# EAGLE design Escubo de LED (EAGLE 6.1)
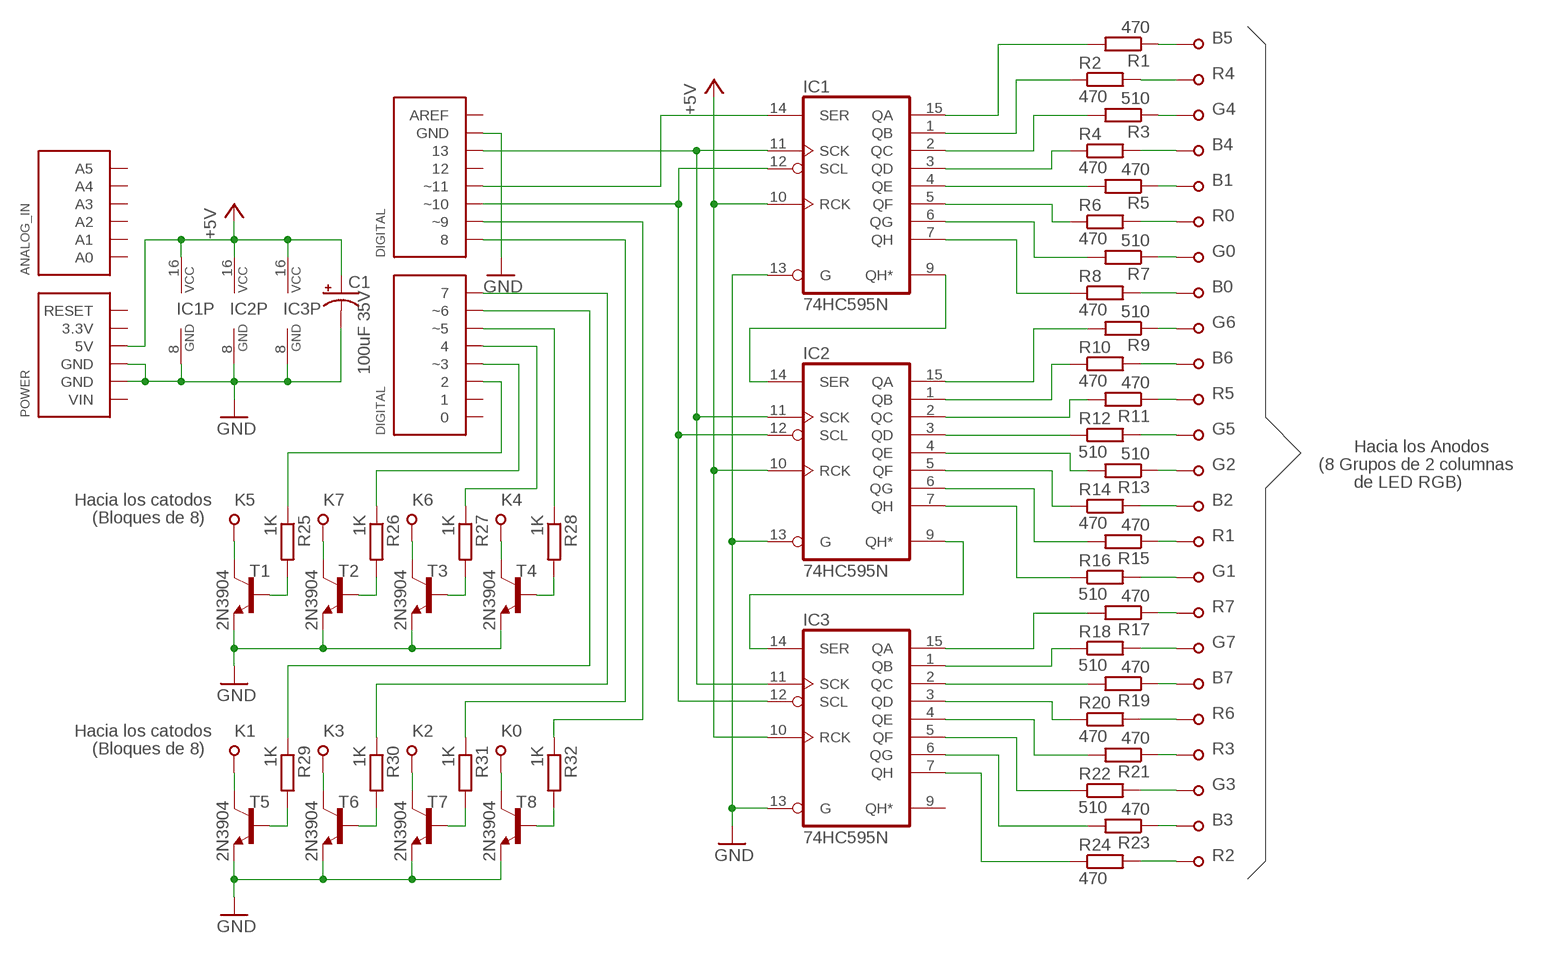
[diagram p0: schematic, sheet 1]

## Parts
C1  100uF 35V  CPOL-USE3.5-8  [E3,5-8]
IC1  74HC595N  [DIP16]
IC2  74HC595N  [DIP16]
IC3  74HC595N  [DIP16]
R1  470  R-EU_0204/7  [0204/7]
R2  470  R-EU_0204/7  [0204/7]
R3  510  R-EU_0204/7  [0204/7]
R4  470  R-EU_0204/7  [0204/7]
R5  470  R-EU_0207/12  [0207/12]
R6  470  R-EU_0207/10  [0207/10]
R7  510  R-EU_0204/7  [0204/7]
R8  470  R-EU_0204/5  [0204/5]
R9  510  R-EU_0204/7  [0204/7]
R10  470  R-EU_0204/7  [0204/7]
R11  470  R-EU_0204/7  [0204/7]
R12  510  R-EU_0204/7  [0204/7]
R13  510  R-EU_0207/12  [0207/12]
R14  470  R-EU_0207/10  [0207/10]
R15  470  R-EU_0204/7  [0204/7]
R16  510  R-EU_0204/5  [0204/5]
R17  470  R-EU_0204/7  [0204/7]
R18  510  R-EU_0204/7  [0204/7]
R19  470  R-EU_0204/7  [0204/7]
R20  470  R-EU_0204/7  [0204/7]
R21  470  R-EU_0207/12  [0207/12]
R22  510  R-EU_0207/10  [0207/10]
R23  470  R-EU_0204/7  [0204/7]
R24  470  R-EU_0204/5  [0204/5]
R25  1K  R-EU_0204/2V  [0204V]
R26  1K  R-EU_0204/2V  [0204V]
R27  1K  R-EU_0204/2V  [0204V]
R28  1K  R-EU_0204/2V  [0204V]
R29  1K  R-EU_0204/2V  [0204V]
R30  1K  R-EU_0204/2V  [0204V]
R31  1K  R-EU_0204/2V  [0204V]
R32  1K  R-EU_0204/2V  [0204V]
S1  ARDUINO_SHIELD  [ARDUINO_SHIELD]
T1  2N3904  2N3904-NPN-TO92-EBC  [TO92-EBC]
T2  2N3904  2N3904-NPN-TO92-EBC  [TO92-EBC]
T3  2N3904  2N3904-NPN-TO92-EBC  [TO92-EBC]
T4  2N3904  2N3904-NPN-TO92-EBC  [TO92-EBC]
T5  2N3904  2N3904-NPN-TO92-EBC  [TO92-EBC]
T6  2N3904  2N3904-NPN-TO92-EBC  [TO92-EBC]
T7  2N3904  2N3904-NPN-TO92-EBC  [TO92-EBC]
T8  2N3904  2N3904-NPN-TO92-EBC  [TO92-EBC]
U$1  PAD_SIMPLE_PTH  [PAD_SIMPLE_PTH]
U$2  PAD_SIMPLE_PTH  [PAD_SIMPLE_PTH]
U$3  PAD_SIMPLE_PTH  [PAD_SIMPLE_PTH]
U$4  PAD_SIMPLE_PTH  [PAD_SIMPLE_PTH]
U$5  PAD_SIMPLE_PTH  [PAD_SIMPLE_PTH]
U$6  PAD_SIMPLE_PTH  [PAD_SIMPLE_PTH]
U$7  PAD_SIMPLE_PTH  [PAD_SIMPLE_PTH]
U$8  PAD_SIMPLE_PTH  [PAD_SIMPLE_PTH]
U$9  PAD_SIMPLE_PTH  [PAD_SIMPLE_PTH]
U$10  PAD_SIMPLE_PTH  [PAD_SIMPLE_PTH]
U$11  PAD_SIMPLE_PTH  [PAD_SIMPLE_PTH]
U$12  PAD_SIMPLE_PTH  [PAD_SIMPLE_PTH]
U$13  PAD_SIMPLE_PTH  [PAD_SIMPLE_PTH]
U$14  PAD_SIMPLE_PTH  [PAD_SIMPLE_PTH]
U$15  PAD_SIMPLE_PTH  [PAD_SIMPLE_PTH]
U$16  PAD_SIMPLE_PTH  [PAD_SIMPLE_PTH]
U$17  PAD_SIMPLE_PTH  [PAD_SIMPLE_PTH]
U$18  PAD_SIMPLE_PTH  [PAD_SIMPLE_PTH]
U$19  PAD_SIMPLE_PTH  [PAD_SIMPLE_PTH]
U$20  PAD_SIMPLE_PTH  [PAD_SIMPLE_PTH]
U$21  PAD_SIMPLE_PTH  [PAD_SIMPLE_PTH]
U$22  PAD_SIMPLE_PTH  [PAD_SIMPLE_PTH]
U$23  PAD_SIMPLE_PTH  [PAD_SIMPLE_PTH]
U$24  PAD_SIMPLE_PTH  [PAD_SIMPLE_PTH]
U$25  PAD_SIMPLE_PTH  [PAD_SIMPLE_PTH]
U$26  PAD_SIMPLE_PTH  [PAD_SIMPLE_PTH]
U$27  PAD_SIMPLE_PTH  [PAD_SIMPLE_PTH]
U$28  PAD_SIMPLE_PTH  [PAD_SIMPLE_PTH]
U$29  PAD_SIMPLE_PTH  [PAD_SIMPLE_PTH]
U$30  PAD_SIMPLE_PTH  [PAD_SIMPLE_PTH]
U$31  PAD_SIMPLE_PTH  [PAD_SIMPLE_PTH]
U$32  PAD_SIMPLE_PTH  [PAD_SIMPLE_PTH]

## Nets
+5V: C1.+ IC1.10(RCK) IC1.16(VCC) IC2.10(RCK) IC2.16(VCC) IC3.10(RCK) IC3.16(VCC) S1.5V(_POWER:5V)
GND: C1.- IC1.8(GND) IC1.13(G) IC2.8(GND) IC2.13(G) IC3.8(GND) IC3.13(G) S1.GND(_POWER:GND) S1.GND@1(_POWER:GND) S1.GND@2(_DIGITAL_H:GND) T1.E T2.E T3.E T4.E T5.E T6.E T7.E T8.E
N$1: IC1.9(QH*) IC2.14(SER)
N$2: IC2.9(QH*) IC3.14(SER)
N$3: IC1.11(SCK) IC2.11(SCK) IC3.11(SCK) S1.13
N$4: IC1.14(SER) S1.~11(_DIGITAL_H:~11)
N$5: IC1.12(SCL) IC2.12(SCL) IC3.12(SCL) S1.~10(_DIGITAL_H:~10)
N$6: IC1.15(QA) R1.2
N$7: IC1.1(QB) R2.1
N$8: IC1.2(QC) R3.2
N$9: IC1.3(QD) R4.1
N$10: IC1.4(QE) R5.2
N$11: IC1.5(QF) R6.1
N$12: IC1.6(QG) R7.2
N$13: IC1.7(QH) R8.1
N$14: IC2.15(QA) R9.2
N$15: IC2.1(QB) R10.1
N$16: IC2.2(QC) R11.2
N$17: IC2.3(QD) R12.1
N$18: IC2.4(QE) R13.2
N$19: IC2.5(QF) R14.1
N$20: IC2.6(QG) R15.2
N$21: IC2.7(QH) R16.1
N$22: IC3.15(QA) R17.2
N$23: IC3.1(QB) R18.1
N$24: IC3.2(QC) R19.2
N$25: IC3.3(QD) R20.1
N$26: IC3.4(QE) R21.2
N$27: IC3.5(QF) R22.1
N$28: IC3.6(QG) R23.2
N$29: IC3.7(QH) R24.1
N$30: R1.1 U$1.P$1
N$31: R2.2 U$2.P$1
N$32: R3.1 U$3.P$1
N$33: R4.2 U$4.P$1
N$34: R6.2 U$6.P$1
N$35: R8.2 U$8.P$1
N$36: R10.2 U$10.P$1
N$37: R12.2 U$12.P$1
N$38: R14.2 U$14.P$1
N$39: R16.2 U$16.P$1
N$40: R18.2 U$18.P$1
N$41: R20.2 U$20.P$1
N$42: R22.2 U$22.P$1
N$43: R24.2 U$24.P$1
N$44: R5.1 U$5.P$1
N$45: R7.1 U$7.P$1
N$46: R9.1 U$9.P$1
N$47: R11.1 U$11.P$1
N$48: R13.1 U$13.P$1
N$49: R15.1 U$15.P$1
N$50: R17.1 U$17.P$1
N$51: R19.1 U$19.P$1
N$52: R21.1 U$21.P$1
N$53: R23.1 U$23.P$1
N$54: R25.1 S1.2
N$55: R26.1 S1.~3(_DIGITAL_L:~3)
N$56: R27.1 S1.4
N$57: R28.1 S1.~5(_DIGITAL_L:~5)
N$58: R29.1 S1.~6(_DIGITAL_L:~6)
N$59: R30.1 S1.7
N$60: R31.1 S1.8
N$61: R32.1 S1.~9(_DIGITAL_H:~9)
N$62: T1.C U$25.P$1
N$63: T2.C U$26.P$1
N$64: T3.C U$27.P$1
N$65: T4.C U$28.P$1
N$66: T5.C U$29.P$1
N$67: T6.C U$30.P$1
N$68: T7.C U$31.P$1
N$69: T8.C U$32.P$1
N$70: R25.2 T1.B
N$71: R26.2 T2.B
N$72: R27.2 T3.B
N$73: R28.2 T4.B
N$74: R29.2 T5.B
N$75: R30.2 T6.B
N$76: R31.2 T7.B
N$77: R32.2 T8.B
Unconnected: IC3.9(QH*) S1.0 S1.1 S1.3.3V(_POWER:3.3V) S1.12 S1.A0(_ANALOG_IN:A0) S1.A1(_ANALOG_IN:A1) S1.A2(_ANALOG_IN:A2) S1.A3(_ANALOG_IN:A3) S1.A4(_ANALOG_IN:A4) S1.A5(_ANALOG_IN:A5) S1.AREF(_DIGITAL_H:AREF) S1.RESET(_POWER:RESET) S1.VIN(_POWER:VIN)

## Notes on the sheet
- B5
- R4
- G4
- B4
- B1
- R0
- G0
- B0
- G6
- B6
- R5
- G5
- Hacia los Anodos
- G2 | (8 Grupos de 2 columnas
- de LED RGB)
- Hacia los catodos | K5 | K7 | K6 | K4 | B2
- (Bloques de 8)
- R1
- G1
- R7
- G7
- B7
- R6
- Hacia los catodos | K1 | K3 | K2 | K0
- (Bloques de 8) | R3
- G3
- B3
- R2

## Library data of the parts
C1 = rcl:CPOL-US: POLARIZED CAPACITOR, American symbol
IC1-IC3 = Personal - Semiconductores:74*595
R1-R32 = rcl:R-EU_: RESISTOR, European symbol
S1 = Personal - Modulos:ARDUINO_SHIELD
T1-T8 = transistor-neu-to92:*-NPN-: NPN Transistror
U$1-U$32 = Personal - Conectores:PAD_SIMPLE

## Board
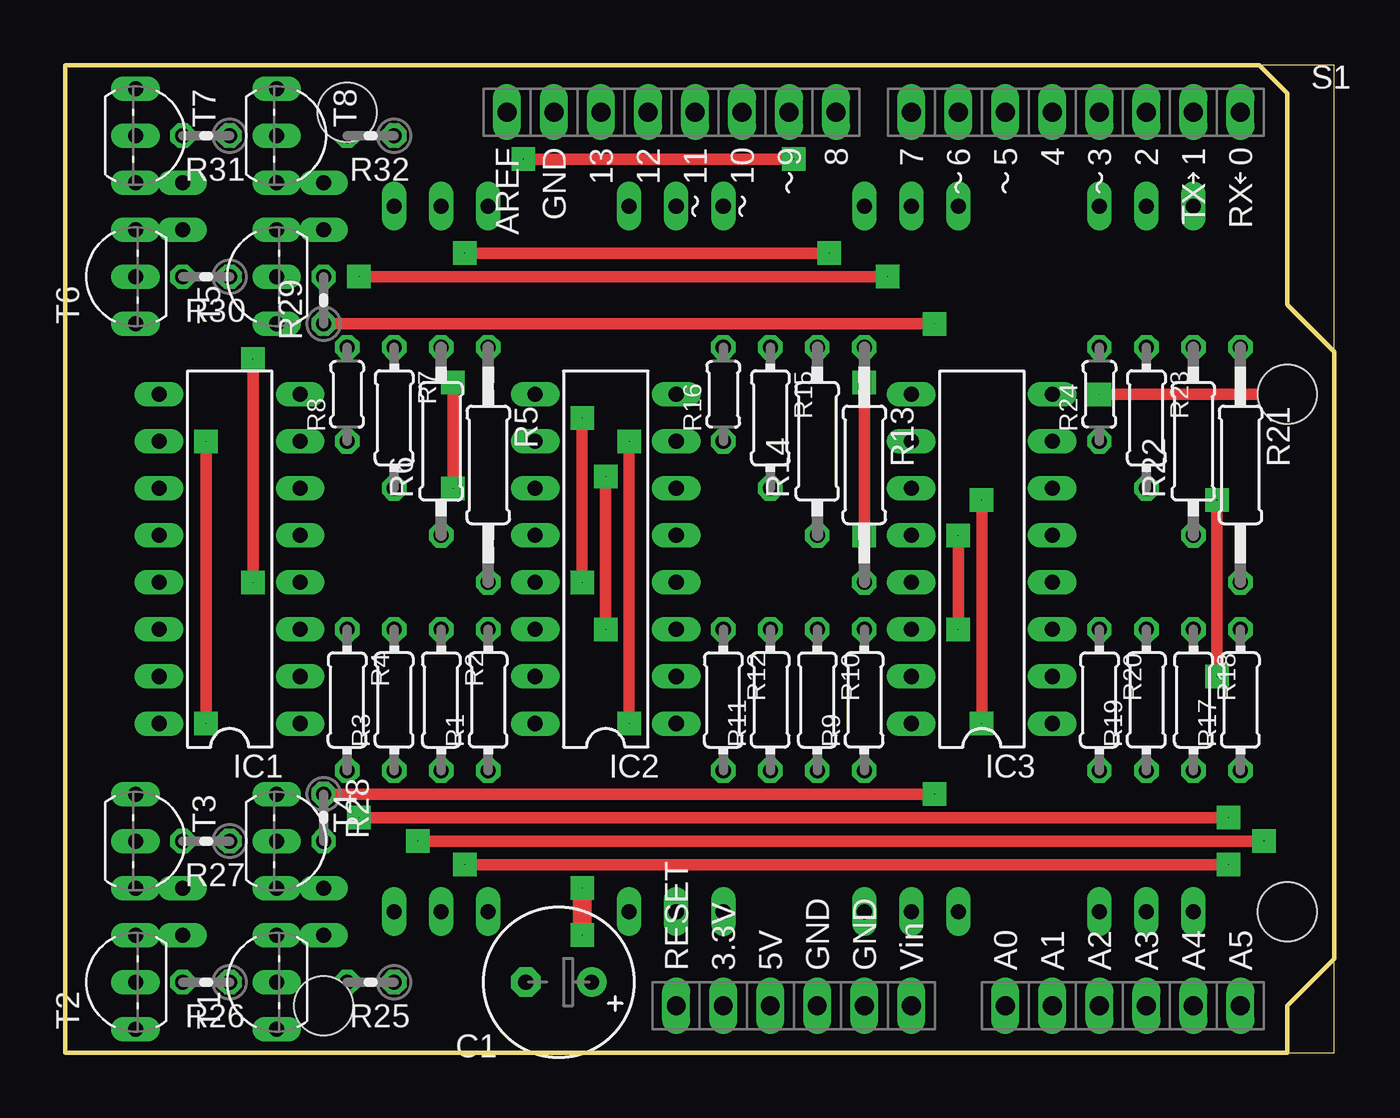
[diagram p1: board, top side]
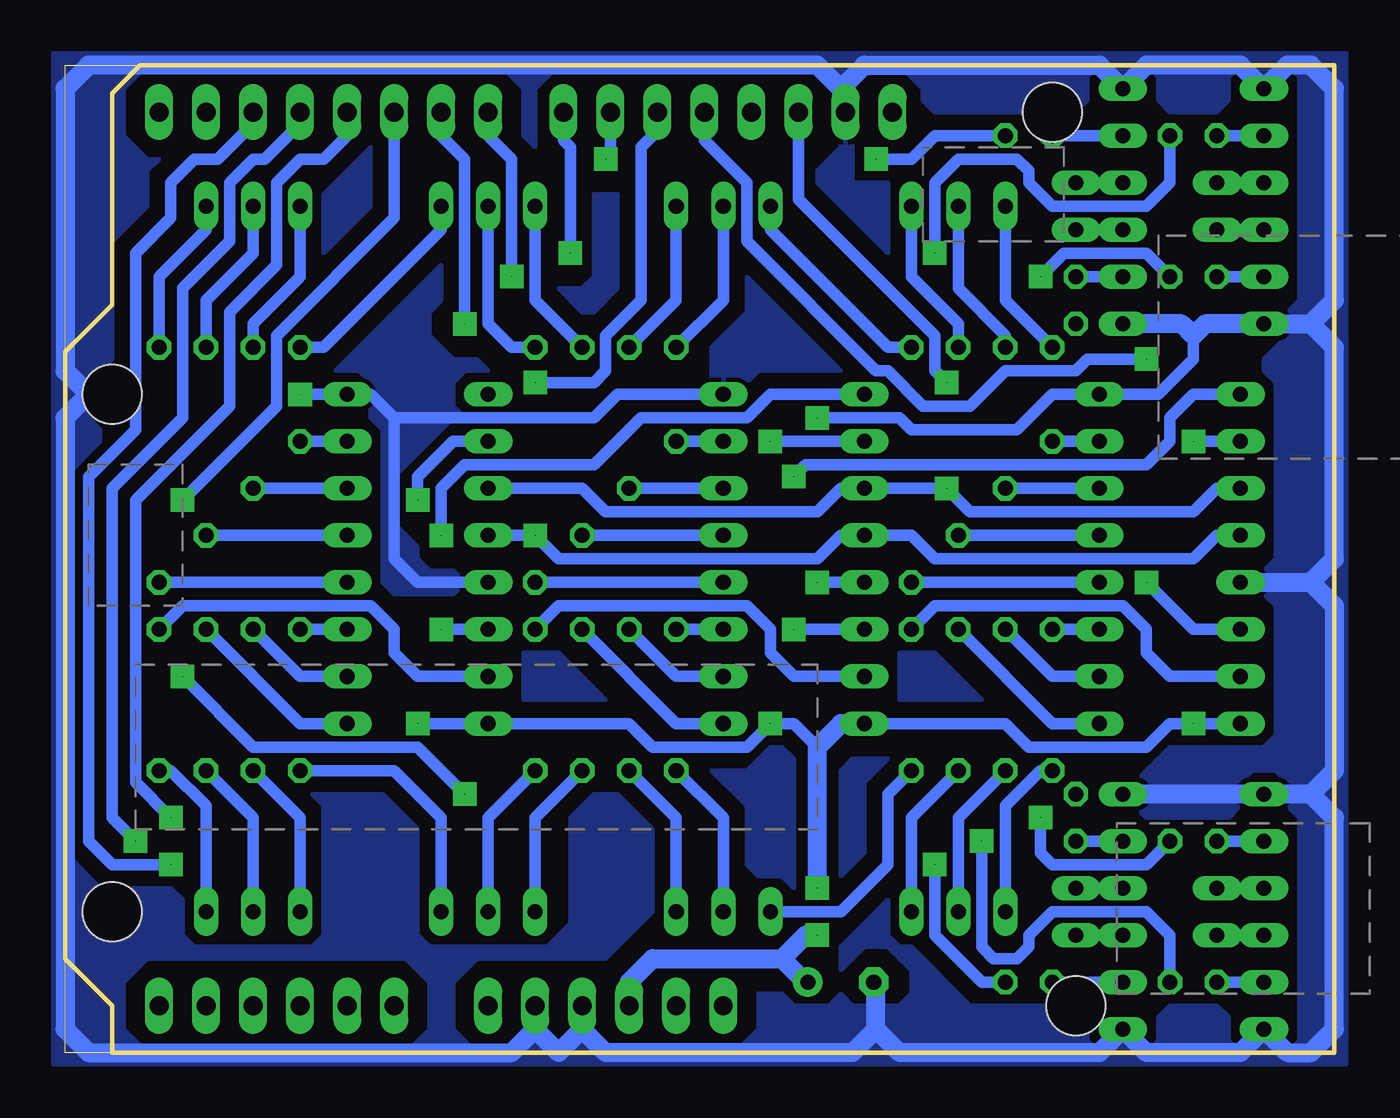
[diagram p2: board, bottom side, seen from below]

Size 68.58 x 53.34 mm. Coordinates in mm from the lower left corner, seen from the top.
Outline: 0,0 68.58,0 68.58,53.34 0,53.34
Copper layers (1*16): Top 0.035mm / dielectric 1.5mm / Bottom 0.035mm
Design rules: minimum track width 24mil, minimum drill 1mil, track to track 12mil, track to pad 12mil, pad to pad 12mil, via to via 12mil, smd to smd 12mil, copper to edge 0mil, drill to drill 8mil, minimum pad ring 10mil, minimum via ring 8mil, stop-mask expansion 4mil, vias tented up to drill 0mil, thermal gap 10mil

### Footprints (pad centres in the part's own frame; a part is rotated, then mirrored left to right if it is on the bottom)
E3,5-8 = drill 0.813 pad 1.6: + -1.778,0 | drill 0.813 pad 1.6 octagon: - 1.778,0
DIP16 = drill 0.813 long: 1 -8.89,-3.81; 2 -6.35,-3.81; 3 -3.81,-3.81; 4 -1.27,-3.81; 5 1.27,-3.81; 6 3.81,-3.81; 7 6.35,-3.81; 8 8.89,-3.81; 9 8.89,3.81; 10 6.35,3.81; 11 3.81,3.81; 12 1.27,3.81; 13 -1.27,3.81; 14 -3.81,3.81; 15 -6.35,3.81; 16 -8.89,3.81
0204/7 = drill 0.813 octagon: 1 -3.81,0; 2 3.81,0
0207/12 = drill 0.813 octagon: 1 -6.35,0; 2 6.35,0
0207/10 = drill 0.813 octagon: 1 -5.08,0; 2 5.08,0
0204/5 = drill 0.813 octagon: 1 -2.54,0; 2 2.54,0
0204V = drill 0.813 octagon: 1 -1.27,0; 2 1.27,0
ARDUINO_SHIELD = drill 1.016 long: 0 63.5,50.8; 1 60.96,50.8; 2 58.42,50.8; 3.3V 35.56,2.54; 4 53.34,50.8; 5V 38.1,2.54; 7 45.72,50.8; 8 41.656,50.8; 12 31.496,50.8; 13 28.956,50.8; A0 50.8,2.54; A1 53.34,2.54; A2 55.88,2.54; A3 58.42,2.54; A4 60.96,2.54; A5 63.5,2.54; AREF 23.876,50.8; GND 40.64,2.54; GND@1 43.18,2.54; GND@2 26.416,50.8; RESET 33.02,2.54; VIN 45.72,2.54; ~3 55.88,50.8; ~5 50.8,50.8; ~6 48.26,50.8; ~9 39.116,50.8; ~10 36.576,50.8; ~11 34.036,50.8 | hole 3.2: 66.04,35.56; 66.04,7.62; 15.24,50.8; 13.97,2.54
TO92-EBC = drill 0.813 long: B 0,-1.27; C 2.54,-1.27; E -2.54,-1.27
PAD_SIMPLE_PTH = drill 0.813 long: P$1 0,0

### Placement (x,y rotation side)
C1  26.67,3.81 180 top
IC1  8.89,26.67 90 top
IC2  29.21,26.67 90 top
IC3  49.53,26.67 90 top
R1  22.86,19.05 90 top
R2  20.32,19.05 270 top
R3  17.78,19.05 90 top
R4  15.24,19.05 270 top
R5  22.86,31.75 270 top
R6  20.32,33.02 90 top
R7  17.78,34.29 270 top
R8  15.24,35.56 90 top
R9  43.18,19.05 90 top
R10  40.64,19.05 270 top
R11  38.1,19.05 90 top
R12  35.56,19.05 270 top
R13  43.18,31.75 270 top
R14  40.64,33.02 90 top
R15  38.1,34.29 270 top
R16  35.56,35.56 90 top
R17  63.5,19.05 90 top
R18  60.96,19.05 270 top
R19  58.42,19.05 90 top
R20  55.88,19.05 270 top
R21  63.5,31.75 270 top
R22  60.96,33.02 90 top
R23  58.42,34.29 270 top
R24  55.88,35.56 90 top
R25  16.51,3.81 180 top
R26  7.62,3.81 180 top
R27  7.62,11.43 180 top
R28  13.97,12.7 270 top
R29  13.97,40.64 90 top
R30  7.62,41.91 180 top
R31  7.62,49.53 180 top
R32  16.51,49.53 180 top
S1  0,0 0 top
T1  10.16,3.81 90 top
T2  2.54,3.81 90 top
T3  5.08,11.43 270 top
T4  12.7,11.43 270 top
T5  10.16,41.91 90 top
T6  2.54,41.91 90 top
T7  5.08,49.53 270 top
T8  12.7,49.53 270 top
U$1  30.48,7.62 270 top
U$2  22.86,7.62 270 top
U$3  20.32,7.62 270 top
U$4  17.78,7.62 270 top
U$5  30.48,45.72 270 top
U$6  22.86,45.72 270 top
U$7  20.32,45.72 270 top
U$8  17.78,45.72 270 top
U$9  45.72,7.62 90 top
U$10  43.18,7.62 90 top
U$11  35.56,7.62 90 top
U$12  33.02,7.62 90 top
U$13  45.72,45.72 270 top
U$14  43.18,45.72 270 top
U$15  35.56,45.72 270 top
U$16  33.02,45.72 270 top
U$17  60.96,7.62 90 top
U$18  58.42,7.62 90 top
U$19  55.88,7.62 90 top
U$20  48.26,7.62 90 top
U$21  60.96,45.72 270 top
U$22  58.42,45.72 270 top
U$23  55.88,45.72 270 top
U$24  48.26,45.72 270 top
U$25  13.97,6.35 0 top
U$26  6.35,6.35 0 top
U$27  6.35,8.89 0 top
U$28  13.97,8.89 180 top
U$29  13.97,44.45 0 top
U$30  6.35,44.45 0 top
U$31  6.35,46.99 0 top
U$32  13.97,46.99 0 top

### Tracks (layer width: path | path; a pad name or v marks a point on that pad's centre or on a via)
+5V  (via drill 0.03 pad 1.27)
  Top 0.61: v7.62,33.02 v7.62,17.78 | v30.48,33.02 v30.48,17.78 | v49.53,29.84 v49.53,17.78
  Top 1.016: v27.94,8.89 v27.94,6.35
  Bottom 0.61: IC1.16 v7.62,17.78 8.89,17.78 10.16,16.51 16.51,16.51 17.78,17.78 IC2.16 | IC1.10 v7.62,33.02 | IC2.10 v30.48,33.02 | 27.94,16.51 29.21,17.78 v30.48,17.78 31.75,16.51 36.83,16.51 38.1,17.78 IC3.16 v49.53,17.78 | IC3.10 47.62,33.02 49.53,31.11 v49.53,29.84
  Bottom 1.016: IC2.16 26.67,17.78 27.94,16.51 v27.94,8.89 | S1.5V 38.1,3.81 36.83,5.08 29.84,5.08 | C1.+ 28.57,3.81 29.84,5.08 | v27.94,6.35 28.57,6.35 29.84,5.08
GND  (via drill 0.03 pad 1.27)
  Top 0.61: v27.94,34.29 v27.94,25.4 | v55.88,35.56 v66.67,35.56
  Bottom 0.61: 7.62,38.73 7.62,37.47 9.53,35.56 IC1.8 15.24,35.56 17.14,33.66 22.86,33.66 23.5,34.29 v27.94,34.29 | 50.8,34.29 52.07,35.56 IC3.8 v55.88,35.56 | 50.8,34.29 50.8,26.67 49.53,25.4 IC3.13 | IC2.8 38.73,35.56 40.01,34.29 50.8,34.29 | v27.94,25.4 IC2.13
  Bottom 1.016: 1.27,39.37 T6.E 6.99,39.37 7.62,38.73 8.26,39.37 T5.E | 1.27,39.37 0,40.64 0,52.07 1.27,53.34 2.54,53.34 T7.E 5.08,53.34 10.16,53.34 T8.E 12.7,53.34 25.4,53.34 26.67,52.07 27.94,53.34 67.31,53.34 68.58,52.07 68.58,36.83 67.31,35.56 | IC1.13 1.27,25.4 | 1.27,25.4 0,26.67 0,38.1 1.27,39.37 | 1.27,25.4 0,24.13 0,15.24 1.27,13.97 | 1.27,13.97 0,12.7 0,1.27 1.27,0 2.54,0 T2.E 5.08,0 10.16,0 T1.E 12.7,0 23.5,0 24.77,1.27 | 40.64,1.27 39.37,0 26.04,0 24.77,1.27 | 40.64,1.27 41.91,0 43.18,1.27 | 43.18,1.27 S1.GND@1 | S1.GND 40.64,1.27 | 67.31,35.56 68.58,34.29 68.58,1.27 67.31,0 44.45,0 43.18,1.27 | S1.GND@2 26.42,51.82 | 1.27,13.97 T3.E T4.E | 24.77,1.27 24.77,3.68 C1.- | 67.31,35.56 v66.67,35.56
  pour Bottom: -0.64,53.98 69.22,53.98 69.22,-0.64 64.14,-0.64 64.14,0 65.41,1.27 65.41,3.81 64.14,5.08 62.23,5.08 62.23,8.26 62.87,8.89 66.67,8.89 68.58,10.79 68.58,31.11 66.67,33.02 66.67,33.66 67.31,34.29 67.31,36.2 66.04,37.47 66.04,43.81 64.14,45.72 64.14,47.62 63.5,48.26 64.14,48.26 65.41,49.53 65.41,52.07 64.14,53.34 45.09,53.34 43.81,52.07 43.81,49.53 43.18,48.9 43.18,52.07 41.91,53.34 27.3,53.34 26.67,52.7 26.67,48.9 27.94,47.62 27.94,46.99 24.13,43.18 24.13,46.99 26.04,46.99 26.04,52.7 25.4,53.34 23.5,53.34 22.23,52.07 22.23,51.44 21.59,50.8 13.97,50.8 13.34,51.44 13.34,52.7 12.7,53.34 12.06,53.34 11.43,52.7 10.79,53.34 10.16,53.34 9.53,52.7 9.53,51.44 8.89,50.8 6.35,50.8 5.71,51.44 5.71,52.7 5.08,53.34 4.45,53.34 3.81,52.7 3.17,53.34 2.54,53.34 1.91,52.7 1.91,40.64 2.54,40.01 2.54,38.73 3.81,37.47 3.81,36.83 3.17,36.2 3.17,26.67 3.81,26.04 3.81,24.77 3.17,24.13 3.17,17.14 3.81,16.51 3.81,15.24 3.17,15.24 2.54,14.61 2.54,13.34 1.91,12.7 1.91,0.64 2.54,0 3.17,0 3.81,0.64 3.81,-0.64 -0.64,-0.64
  pour Bottom: 3.81,16.51 8.89,16.51 10.79,14.61 10.79,13.34 10.16,12.7 5.71,12.7 5.08,13.34 5.08,14.61 4.45,15.24 3.81,15.24
  pour Bottom: 26.67,36.83 31.75,41.91 31.75,40.01 33.66,38.1 33.66,35.56 32.38,35.56 31.11,36.83
  pour Bottom: 45.72,36.83 46.35,37.47 47.62,37.47 48.9,38.73 48.9,40.01 48.26,40.64 48.26,42.55 53.98,36.83 52.7,36.83 52.07,36.2 52.07,34.29 51.44,33.66 51.44,25.4 50.8,24.77 47.62,24.77 46.99,25.4 47.62,26.04 48.9,26.04 49.53,26.67 49.53,27.3 50.8,28.57 50.8,31.11 47.62,34.29 46.99,34.29 47.62,34.92 47.62,36.2 46.99,36.83
  pour Bottom: 3.81,0.64 4.45,0 5.08,0 5.71,0.64 5.71,1.91 6.35,2.54 8.89,2.54 9.53,1.91 9.53,0.64 10.16,0 10.79,0 11.43,0.64 12.06,0 12.7,0 13.34,0.64 13.34,1.91 13.97,2.54 19.68,2.54 22.86,5.71 23.5,5.71 24.13,6.35 24.13,8.26 26.67,5.71 26.67,4.45 25.4,5.71 24.13,5.71 22.86,4.45 22.86,3.17 23.5,2.54 26.04,2.54 26.67,3.17 27.3,2.54 29.21,2.54 29.84,3.17 31.11,3.17 31.11,1.27 32.38,0 40.01,0 40.64,0.64 41.27,0 42.55,0 43.18,0.64 43.81,0 46.35,0 47.62,1.27 47.62,3.81 46.35,5.08 39.37,5.08 36.83,7.62 36.83,12.06 38.73,13.97 40.01,13.97 41.27,12.7 41.27,6.99 42.55,5.71 48.9,5.71 49.53,6.35 49.53,12.06 51.44,13.97 55.24,13.97 54.61,13.34 54.61,6.35 55.24,5.71 61.59,5.71 62.23,6.35 62.23,5.08 50.16,5.08 48.9,3.81 48.9,1.27 50.16,0 64.14,0 64.14,-0.64 3.81,-0.64
N$1  (via drill 0.03 pad 1.27)
  Top 0.61: v29.21,31.11 v29.21,22.86
  Bottom 0.61: IC1.9 7.62,35.56 8.89,34.29 8.89,33.02 10.16,31.75 28.57,31.75 v29.21,31.11 | IC2.14 v29.21,22.86
N$2  (via drill 0.03 pad 1.27)
  Top 0.61: v48.26,27.94 v48.26,22.86
  Bottom 0.61: IC2.9 30.48,35.56 31.75,34.29 37.47,34.29 40.01,31.75 46.99,31.75 48.26,30.48 v48.26,27.94 | v48.26,22.86 IC3.14
N$3  (via drill 0.03 pad 1.27)
  Top 0.61: v20.95,36.2 v20.95,30.48
  Bottom 0.61: S1.13 28.96,46.1 21.59,38.73 21.59,36.83 v20.95,36.2 | IC1.11 6.35,30.48 7.62,29.21 19.68,29.21 v20.95,30.48 IC2.11 26.67,30.48 27.94,29.21 39.37,29.21 40.64,30.48 IC3.11
N$4  (via drill 0.03 pad 1.27)
  Top 0.61: v10.16,37.47 v10.16,25.4
  Bottom 0.61: S1.~11 34.04,49.28 31.75,46.99 31.75,43.81 24.77,36.83 24.13,36.83 22.23,34.92 19.68,34.92 17.78,36.83 13.97,36.83 13.34,37.47 v10.16,37.47 | v10.16,25.4 7.62,22.86 IC1.14
N$5  (via drill 0.03 pad 1.27)
  Top 0.61: v43.18,36.2 v43.18,27.94
  Bottom 0.61: S1.~10 36.58,49.78 37.47,48.9 37.47,40.64 39.37,38.73 39.37,36.83 40.01,36.2 v43.18,36.2 | IC1.12 6.35,27.94 7.62,26.67 21.59,26.67 22.86,27.94 IC2.12 26.67,27.94 27.94,26.67 41.91,26.67 v43.18,27.94 IC3.12
N$6
  Bottom 0.61: IC1.15 8.89,20.32 10.16,21.59 10.16,22.86 11.43,24.13 21.59,24.13 R1.2
N$7
  Bottom 0.61: IC1.1 15.24,17.78 R2.1
N$8
  Bottom 0.61: IC1.2 15.24,20.32 R3.2
N$9
  Bottom 0.61: IC1.3 R4.1
N$10
  Bottom 0.61: IC1.4 R5.2
N$11
  Bottom 0.61: IC1.5 R6.1
N$12
  Bottom 0.61: IC1.6 R7.2
N$13
  Bottom 0.61: R8.1 IC1.7
N$14
  Bottom 0.61: IC2.15 29.21,20.32 30.48,21.59 30.48,22.86 31.75,24.13 41.91,24.13 R9.2
N$15
  Bottom 0.61: IC2.1 35.56,17.78 R10.1
N$16
  Bottom 0.61: IC2.2 35.56,20.32 R11.2
N$17
  Bottom 0.61: IC2.3 R12.1
N$18
  Bottom 0.61: R13.2 IC2.4
N$19
  Bottom 0.61: IC2.5 R14.1
N$20
  Bottom 0.61: IC2.6 R15.2
N$21
  Bottom 0.61: IC2.7 R16.1
N$22
  Bottom 0.61: IC3.15 49.53,20.32 50.8,21.59 50.8,22.86 52.07,24.13 62.23,24.13 R17.2
N$23
  Bottom 0.61: IC3.1 55.88,17.78 R18.1
N$24
  Bottom 0.61: IC3.2 55.88,20.32 R19.2
N$25
  Bottom 0.61: IC3.3 R20.1
N$26
  Bottom 0.61: IC3.4 R21.2
N$27
  Bottom 0.61: IC3.5 R22.1
N$28
  Bottom 0.61: IC3.6 R23.2
N$29
  Bottom 0.61: IC3.7 R24.1
N$30
  Bottom 0.61: R1.1 24.13,13.97 24.13,10.16 26.67,7.62 U$1.P$1
N$31
  Bottom 0.61: U$2.P$1 22.86,12.7 R2.2
N$32
  Bottom 0.61: U$3.P$1 20.32,12.7 R3.1
N$33
  Bottom 0.61: R4.2 15.88,15.24 17.78,13.34 U$4.P$1
N$34
  Bottom 0.61: U$6.P$1 22.86,41.91 20.32,39.37 R6.2
N$35
  Bottom 0.61: U$8.P$1 17.78,40.64 R8.2
N$36
  Bottom 0.61: R10.2 43.18,12.7 U$10.P$1
N$37
  Bottom 0.61: R12.2 33.02,12.7 U$12.P$1
N$38
  Bottom 0.61: R14.2 43.18,40.64 U$14.P$1
N$39
  Bottom 0.61: U$16.P$1 33.02,40.64 R16.2
N$40
  Bottom 0.61: U$18.P$1 58.42,12.7 R18.2
N$41
  Bottom 0.61: U$20.P$1 48.26,12.7 50.8,15.24 R20.2
N$42
  Bottom 0.61: R22.2 60.96,40.64 58.42,43.18 U$22.P$1
N$43
  Bottom 0.61: U$24.P$1 48.26,44.45 54.61,38.1 R24.2
N$44
  Bottom 0.61: R5.1 24.13,38.1 30.48,44.45 U$5.P$1
N$45
  Bottom 0.61: U$7.P$1 20.32,41.27 17.78,38.73 R7.1
N$46
  Bottom 0.61: R9.1 45.72,12.7 U$9.P$1
N$47
  Bottom 0.61: R11.1 35.56,12.7 U$11.P$1
N$48
  Bottom 0.61: R13.1 44.45,38.1 45.72,39.37 U$13.P$1
N$49
  Bottom 0.61: U$15.P$1 35.56,40.64 R15.1
N$50
  Bottom 0.61: U$17.P$1 60.96,13.34 62.87,15.24 R17.1
N$51
  Bottom 0.61: R19.1 55.88,12.7 U$19.P$1
N$52
  Bottom 0.61: U$21.P$1 60.96,44.45 63.5,41.91 R21.1
N$53
  Bottom 0.61: U$23.P$1 55.88,41.91 58.42,39.37 R23.1
N$54  (via drill 0.03 pad 1.27)
  Top 0.61: v62.87,10.16 v21.59,10.16
  Bottom 0.61: S1.2 58.42,50.16 60.33,48.26 61.59,48.26 62.87,46.99 62.87,45.09 64.77,43.18 64.77,33.66 67.31,31.11 67.31,11.43 66.04,10.16 v62.87,10.16 | v21.59,10.16 21.59,6.35 19.05,3.81 R25.1
N$55  (via drill 0.03 pad 1.27)
  Top 0.61: v19.05,11.43 v64.77,11.43
  Bottom 0.61: S1.~3 55.88,50.16 57.78,48.26 58.42,48.26 59.69,46.99 59.69,43.81 62.23,41.27 62.23,34.29 66.04,30.48 66.04,12.7 v64.77,11.43 | R26.1 8.89,6.35 10.16,7.62 15.24,7.62 16.51,6.35 16.51,5.71 17.14,5.08 18.41,5.08 19.05,5.71 v19.05,11.43
N$56  (via drill 0.03 pad 1.27)
  Top 0.61: v15.88,12.7 v62.87,12.7
  Bottom 0.61: S1.4 53.34,49.53 54.61,48.26 55.88,48.26 57.15,46.99 57.15,42.55 59.69,40.01 59.69,34.92 64.77,29.84 64.77,14.61 v62.87,12.7 | R27.1 10.16,10.16 15.24,10.16 15.88,10.79 v15.88,12.7
N$57  (via drill 0.03 pad 1.27)
  Top 0.61: v62.23,29.84 v62.23,20.32 | R28.1 v46.99,13.97
  Bottom 0.61: S1.~5 50.8,45.09 57.15,38.73 57.15,34.92 v62.23,29.84 | v62.23,20.32 58.42,16.51 49.53,16.51 v46.99,13.97
N$58  (via drill 0.03 pad 1.27)
  Top 0.61: R29.1 v46.99,39.37
  Bottom 0.61: S1.~6 48.26,49.53 46.99,48.26 v46.99,39.37
N$59  (via drill 0.03 pad 1.27)
  Top 0.61: v15.88,41.91 v44.45,41.91
  Bottom 0.61: S1.7 45.72,49.53 44.45,48.26 v44.45,41.91 | R30.1 10.16,43.18 14.61,43.18 v15.88,41.91
N$60  (via drill 0.03 pad 1.27)
  Top 0.61: v21.59,43.18 v41.27,43.18
  Bottom 0.61: S1.8 41.66,49.28 41.27,48.9 v41.27,43.18 | R31.1 8.89,46.99 10.16,45.72 15.24,45.72 16.51,46.99 16.51,47.62 17.14,48.26 20.32,48.26 21.59,46.99 v21.59,43.18
N$61  (via drill 0.03 pad 1.27)
  Top 0.61: v24.77,48.26 v39.37,48.26
  Bottom 0.61: v24.77,48.26 22.86,48.26 21.59,49.53 R32.1 | S1.~9 39.12,48.51 v39.37,48.26
N$62
  Bottom 0.61: T1.C U$25.P$1
N$63
  Bottom 0.61: T2.C U$26.P$1
N$64
  Bottom 0.61: T3.C U$27.P$1
N$65
  Bottom 0.61: T4.C U$28.P$1
N$66
  Bottom 0.61: T5.C U$29.P$1
N$67
  Bottom 0.61: T6.C U$30.P$1
N$68
  Bottom 0.61: T7.C U$31.P$1
N$69
  Bottom 0.61: T8.C U$32.P$1
N$70
  Bottom 0.61: T1.B R25.2
N$71
  Bottom 0.61: T2.B R26.2
N$72
  Bottom 0.61: T3.B R27.2
N$73
  Bottom 0.61: T4.B R28.2
N$74
  Bottom 0.61: T5.B R29.2
N$75
  Bottom 0.61: T6.B R30.2
N$76
  Bottom 0.61: T7.B R31.2
N$77
  Bottom 0.61: R32.2 T8.B
N$78
  pour Bottom: 39.37,19.05 41.91,21.59 43.81,21.59 43.81,19.05
N$79
  pour Bottom: 19.05,19.05 21.59,21.59 23.5,21.59 23.5,19.05
N$80
  pour Bottom: 52.07,48.9 54.61,46.35 54.61,43.18 52.07,45.72
N$81
  pour Bottom: 38.73,46.35 40.01,46.35 40.01,41.91 40.64,41.27 41.91,41.27 40.64,40.01 40.01,40.01 38.73,41.27
N$82
  pour Bottom: 24.13,15.88 26.04,15.88 26.67,15.24 26.67,9.53 25.4,10.79 25.4,14.61
N$83
  pour Bottom: 29.21,15.88 29.84,16.51 30.48,16.51 31.75,15.24 33.66,15.24 31.75,13.34 31.75,10.16 31.11,9.53 29.84,9.53 29.21,8.89

### Text on the board
tValues: K2 | K0 | K3 | K1 | B0 | G0 | R0 | B1 | G1 | R1 | B2 | G2 | R2 | B3 | G3 | R3 | B4 | G4 | R4 | B5 | G5 | R5 | B6 | G6 | R6 | B7 | G7 | R7 | K6 | K4 | K7 | K5